# Altium schematic sheet Sheet_1_2026-06-06.schdoc
size 45 x 28 mm
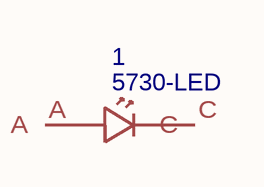
[diagram p0: Sheet_1_2026-06-06.schdoc]

## Parts
1  5730-LED  [5730-LED]

## Nets

Not connected (* = marked no-connect by the designer): 1 A C

## Library data of the parts
1 = 5730-LED: Contributor: wystewart; spicePre: ?; spiceSymbolName: 5730-LED